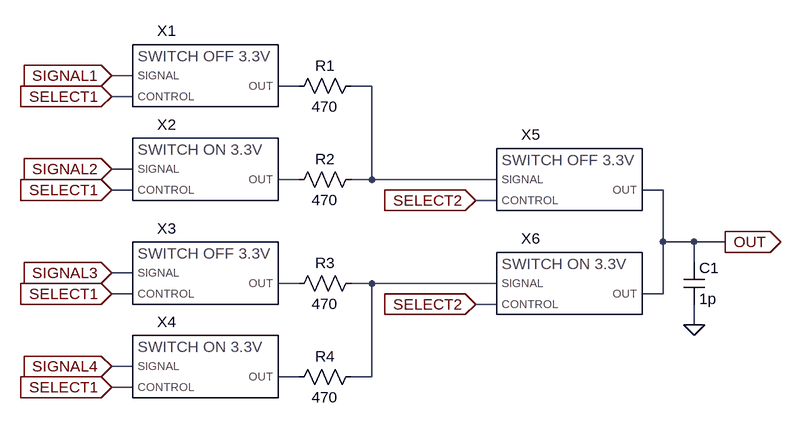
[diagram p0: schematic switch4_3.3v.asc]
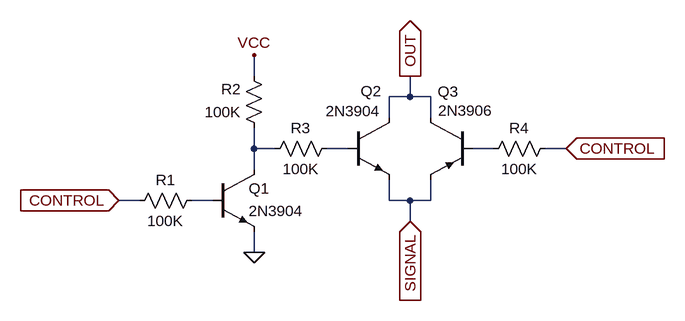
[diagram p1: sub-circuit switch_off_3.3v.asc]
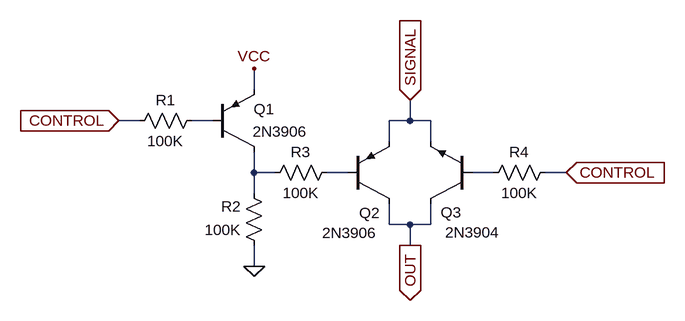
[diagram p2: sub-circuit switch_on_3.3v.asc]
switch4_3.3v.asc, the LTspice schematic file:
Version 4
SHEET 1 1148 712
WIRE 80 160 48 160
WIRE 336 176 304 176
WIRE 448 176 416 176
WIRE 80 192 48 192
WIRE 80 304 48 304
WIRE 336 320 304 320
WIRE 448 320 448 176
WIRE 448 320 416 320
WIRE 640 320 448 320
WIRE 80 336 48 336
WIRE 896 336 864 336
WIRE 640 352 608 352
WIRE 896 416 896 336
WIRE 944 416 896 416
WIRE 992 416 944 416
WIRE 944 448 944 416
WIRE 80 464 48 464
WIRE 336 480 304 480
WIRE 448 480 416 480
WIRE 640 480 448 480
WIRE 80 496 48 496
WIRE 896 496 896 416
WIRE 896 496 864 496
WIRE 640 512 608 512
WIRE 944 544 944 512
WIRE 80 608 48 608
WIRE 336 624 304 624
WIRE 448 624 448 480
WIRE 448 624 416 624
WIRE 80 640 48 640
FLAG 48 160 SIGNAL1
IOPIN 48 160 In
FLAG 48 304 SIGNAL2
IOPIN 48 304 In
FLAG 48 464 SIGNAL3
IOPIN 48 464 In
FLAG 48 608 SIGNAL4
IOPIN 48 608 In
FLAG 48 192 SELECT1
IOPIN 48 192 In
FLAG 48 336 SELECT1
IOPIN 48 336 In
FLAG 48 496 SELECT1
IOPIN 48 496 In
FLAG 48 640 SELECT1
IOPIN 48 640 In
FLAG 608 352 SELECT2
IOPIN 608 352 In
FLAG 608 512 SELECT2
IOPIN 608 512 In
FLAG 992 416 OUT
IOPIN 992 416 Out
FLAG 944 544 0
SYMBOL res 432 160 R90
WINDOW 0 0 56 VBottom 2
WINDOW 3 32 56 VTop 2
SYMATTR InstName R1
SYMATTR Value 470
SYMBOL res 432 304 R90
WINDOW 0 0 56 VBottom 2
WINDOW 3 32 56 VTop 2
SYMATTR InstName R2
SYMATTR Value 470
SYMBOL res 432 464 R90
WINDOW 0 0 56 VBottom 2
WINDOW 3 32 56 VTop 2
SYMATTR InstName R3
SYMATTR Value 470
SYMBOL res 432 608 R90
WINDOW 0 0 56 VBottom 2
WINDOW 3 32 56 VTop 2
SYMATTR InstName R4
SYMATTR Value 470
SYMBOL switch_off_3.3v 128 192 R0
SYMATTR InstName X1
SYMBOL switch_on_3.3v 128 336 R0
SYMATTR InstName X2
SYMBOL switch_off_3.3v 128 496 R0
SYMATTR InstName X3
SYMBOL switch_on_3.3v 128 640 R0
SYMATTR InstName X4
SYMBOL switch_off_3.3v 688 352 R0
SYMATTR InstName X5
SYMBOL switch_on_3.3v 688 512 R0
SYMATTR InstName X6
SYMBOL cap 928 448 R0
SYMATTR InstName C1
SYMATTR Value 1p

switch_off_3.3v.asc, the sub-circuit schematic file:
Version 4
SHEET 1 2264 680
WIRE 416 160 416 128
WIRE 656 192 656 160
WIRE 656 192 624 192
WIRE 688 192 656 192
WIRE 624 224 624 192
WIRE 688 224 688 192
WIRE 416 272 416 240
WIRE 448 272 416 272
WIRE 560 272 528 272
WIRE 784 272 752 272
WIRE 896 272 864 272
WIRE 416 304 416 272
WIRE 240 352 208 352
WIRE 352 352 320 352
WIRE 624 352 624 320
WIRE 656 352 624 352
WIRE 688 352 688 320
WIRE 688 352 656 352
WIRE 656 384 656 352
WIRE 416 432 416 400
FLAG 416 128 VCC
FLAG 416 432 0
FLAG 656 384 SIGNAL
IOPIN 656 384 In
FLAG 896 272 CONTROL
IOPIN 896 272 In
FLAG 208 352 CONTROL
IOPIN 208 352 In
FLAG 656 160 OUT
IOPIN 656 160 Out
SYMBOL res 432 256 R180
WINDOW 0 36 76 Left 2
WINDOW 3 36 40 Left 2
SYMATTR InstName R2
SYMATTR Value 100K
SYMBOL npn 352 304 R0
WINDOW 0 56 29 Left 2
WINDOW 3 56 64 Left 2
SYMATTR InstName Q1
SYMATTR Value 2N3904
SYMBOL res 336 336 R90
WINDOW 0 0 56 VBottom 2
WINDOW 3 32 56 VTop 2
SYMATTR InstName R1
SYMATTR Value 100K
SYMBOL npn 560 224 R0
WINDOW 0 20 -41 Left 2
WINDOW 3 -34 -10 Left 2
SYMATTR InstName Q2
SYMATTR Value 2N3904
SYMBOL pnp 752 224 M0
WINDOW 0 21 -40 Left 2
WINDOW 3 -32 -11 Left 2
SYMATTR InstName Q3
SYMATTR Value 2N3906
SYMBOL res 768 288 R270
WINDOW 0 32 56 VTop 2
WINDOW 3 0 56 VBottom 2
SYMATTR InstName R4
SYMATTR Value 100K
SYMBOL res 544 256 R90
WINDOW 0 0 56 VBottom 2
WINDOW 3 32 56 VTop 2
SYMATTR InstName R3
SYMATTR Value 100K

switch_on_3.3v.asc, the sub-circuit schematic file:
Version 4
SHEET 1 2264 680
WIRE 416 -304 416 -336
WIRE 240 -256 208 -256
WIRE 352 -256 320 -256
WIRE 656 -256 656 -288
WIRE 656 -256 624 -256
WIRE 688 -256 656 -256
WIRE 624 -224 624 -256
WIRE 688 -224 688 -256
WIRE 416 -176 416 -208
WIRE 448 -176 416 -176
WIRE 560 -176 528 -176
WIRE 784 -176 752 -176
WIRE 896 -176 864 -176
WIRE 416 -144 416 -176
WIRE 624 -96 624 -128
WIRE 656 -96 624 -96
WIRE 688 -96 688 -128
WIRE 688 -96 656 -96
WIRE 656 -64 656 -96
WIRE 416 -32 416 -64
FLAG 896 -176 CONTROL
IOPIN 896 -176 In
FLAG 656 -288 SIGNAL
IOPIN 656 -288 In
FLAG 416 -336 VCC
FLAG 416 -32 0
FLAG 208 -256 CONTROL
IOPIN 208 -256 In
FLAG 656 -64 OUT
IOPIN 656 -64 Out
SYMBOL npn 752 -128 R180
WINDOW 0 17 -13 Left 2
WINDOW 3 -43 -44 Left 2
SYMATTR InstName Q3
SYMATTR Value 2N3904
SYMBOL res 880 -192 R90
WINDOW 0 0 56 VBottom 2
WINDOW 3 32 56 VTop 2
SYMATTR InstName R4
SYMATTR Value 100K
SYMBOL pnp 560 -128 M180
WINDOW 0 18 -14 Left 2
WINDOW 3 -39 -45 Left 2
SYMATTR InstName Q2
SYMATTR Value 2N3906
SYMBOL res 432 -48 R180
WINDOW 0 36 76 Left 2
WINDOW 3 36 40 Left 2
SYMATTR InstName R2
SYMATTR Value 100K
SYMBOL res 336 -272 R90
WINDOW 0 0 56 VBottom 2
WINDOW 3 32 56 VTop 2
SYMATTR InstName R1
SYMATTR Value 100K
SYMBOL pnp 352 -208 M180
WINDOW 0 63 66 Left 2
WINDOW 3 62 31 Left 2
SYMATTR InstName Q1
SYMATTR Value 2N3906
SYMBOL res 544 -192 R90
WINDOW 0 0 56 VBottom 2
WINDOW 3 32 56 VTop 2
SYMATTR InstName R3
SYMATTR Value 100K

The netlist it stands for:
* switch4_3.3v.asc
R1 N002 N001 470
R2 N002 N003 470
R3 N005 N004 470
R4 N005 N006 470
XX1 SELECT1 SIGNAL1 N001 switch_off_3.3v
XX2 SELECT1 SIGNAL2 N003 switch_on_3.3v
XX3 SELECT1 SIGNAL3 N004 switch_off_3.3v
XX4 SELECT1 SIGNAL4 N006 switch_on_3.3v
XX5 SELECT2 N002 OUT switch_off_3.3v
XX6 SELECT2 N005 OUT switch_on_3.3v
C1 OUT 0 1p

* block symbol definitions
.subckt switch_off_3.3v CONTROL SIGNAL OUT
R2 N001 VCC 100K
Q1 N001 N004 0 0 2N3904
R1 N004 CONTROL 100K
Q2 OUT N002 SIGNAL 0 2N3904
Q3 OUT N003 SIGNAL 0 2N3906
R4 N003 CONTROL 100K
R3 N002 N001 100K
.ends switch_off_3.3v

.subckt switch_on_3.3v CONTROL SIGNAL OUT
Q3 OUT N004 SIGNAL 0 2N3904
R4 CONTROL N004 100K
Q2 OUT N003 SIGNAL 0 2N3906
R2 0 N002 100K
R1 N001 CONTROL 100K
Q1 N002 N001 VCC 0 2N3906
R3 N003 N002 100K
.ends switch_on_3.3v

.model NPN NPN
.model PNP PNP
.lib standard.bjt
.backanno
.end